# Altium schematic sheet SDCard.SchDoc
size A4; SheetNumber: 6; SheetTotal: 8
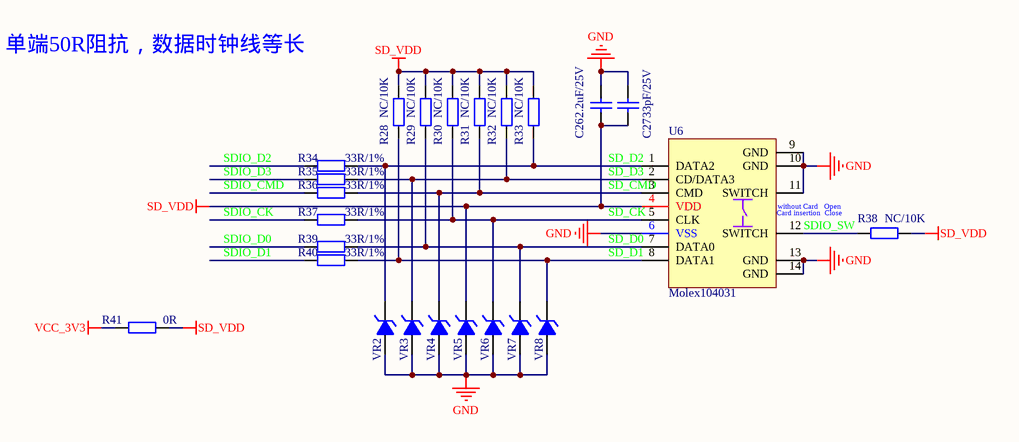
[diagram p0: SDCard.SchDoc]

## Parts
C26  2.2uF/25V  [C0402_L]
C27  33pF/25V  [C0402_L]
R28  NC/10K  [R0402_L]
R29  NC/10K  [R0402_L]
R30  NC/10K  [R0402_L]
R31  NC/10K  [R0402_L]
R32  NC/10K  [R0402_L]
R33  NC/10K  [R0402_L]
R34  33R/1%  [R0402_L]
R35  33R/1%  [R0402_L]
R36  33R/1%  [R0402_L]
R37  33R/1%  [R0402_L]
R38  NC/10K  [R0402_L]
R39  33R/1%  [R0402_L]
R40  33R/1%  [R0402_L]
R41  0R  [R0402_L]
U6  Molex104031  [插拔式MicroSD卡]
VR2  ESD9D5U  [SOD-923]  (value not drawn)
VR3  ESD9D5U  [SOD-923]  (value not drawn)
VR4  ESD9D5U  [SOD-923]  (value not drawn)
VR5  ESD9D5U  [SOD-923]  (value not drawn)
VR6  ESD9D5U  [SOD-923]  (value not drawn)
VR7  ESD9D5U  [SOD-923]  (value not drawn)
VR8  ESD9D5U  [SOD-923]  (value not drawn)

## Nets
GND: C26.2 C27.2 U6.6(VSS) U6.9(GND) U6.10(GND) U6.11(SWITCH) U6.13(GND) U6.14(GND) VR2.2(A) VR3.2(A) VR4.2(A) VR5.2(A) VR6.2(A) VR7.2(A) VR8.2(A)
SD_VDD: C26.1 C27.1 R28.2 R29.2 R30.2 R31.2 R32.2 R33.2 R38.1 R41.2 U6.4(VDD) VR5.1(K)
VCC_3V3: R41.1
SD_CK: R30.1 R37.2 U6.5(CLK) VR6.1(K)
SD_CMD: R31.1 R36.2 U6.3(CMD) VR4.1(K)
SD_D0: R29.1 R39.2 U6.7(DATA0) VR7.1(K)
SD_D1: R28.1 R40.2 U6.8(DATA1) VR8.1(K)
SD_D2: R33.1 R34.2 U6.1(DATA2) VR2.1(K)
SD_D3: R32.1 R35.2 U6.2(CD/DATA3) VR3.1(K)
SDIO_CK: R37.1
SDIO_CMD: R36.1
SDIO_D0: R39.1
SDIO_D1: R40.1
SDIO_D2: R34.1
SDIO_D3: R35.1
SDIO_SW: R38.2 U6.12(SWITCH)

## Notes on the sheet
- 单端50R阻抗，数据时钟线等长
- (near U6) without Card   Open
- (near U6) Card insertion  Close

## Library data of the parts
C26 C27 = C: 贴片电容; BOM名称: 无极性贴片电容; 联系卖家，免费查找封装: 唯一出售店铺网址https://shop463601444.taobao.com
R28-R41 = R: 贴片电阻; 联系卖家，免费查找封装: 唯一出售店铺网址https://shop463601444.taobao.com; BOM名称: 贴片电阻
U6 = Molex104031: 拔插式超薄TF卡座
VR2-VR8 = Diode4: 瞬态电压抑制二极管; pin to pad: 1>2 2>1